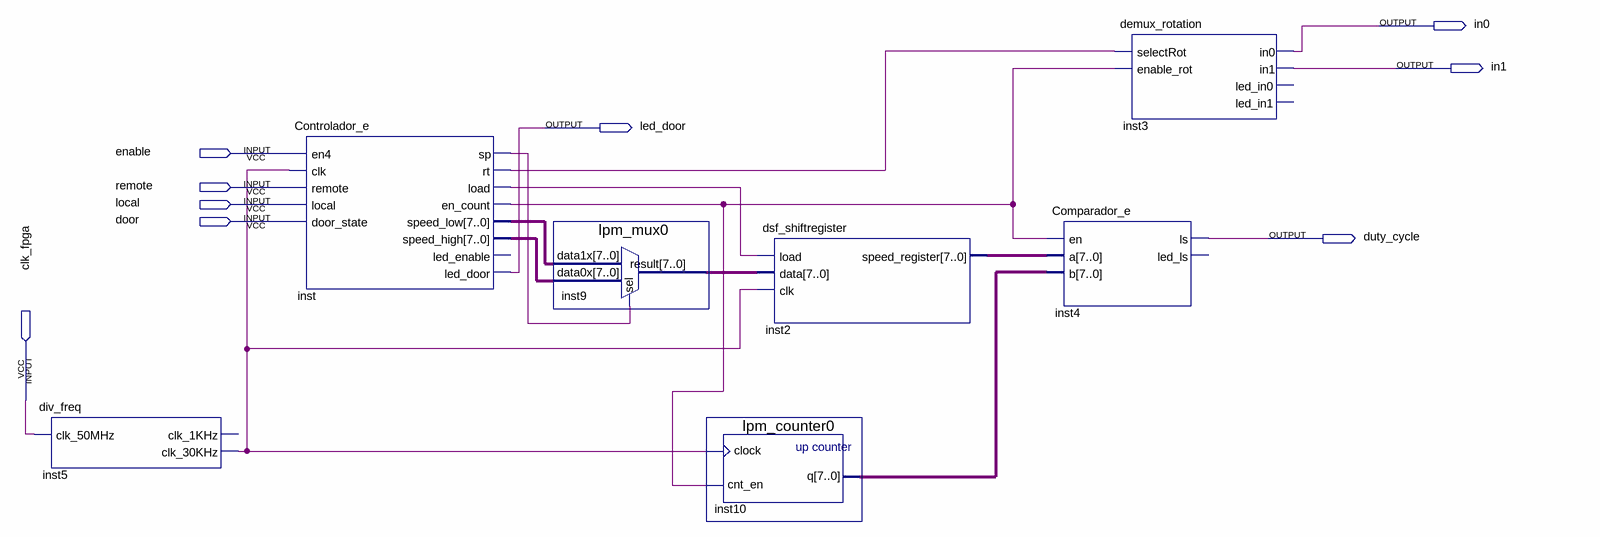
[diagram p0: schematic sheet]
// Quartus schematic motor.bdf as structural Verilog: 7 symbols, 9 pins
module motor (
  input  enable,
  input  remote,
  input  \local ,
  input  door,
  input  clk_fpga,
  output in0,
  output in1,
  output led_door,
  output duty_cycle
);

  wire inst5_clk_30khz, inst_en_count, inst_load, inst_rt, inst_sp;
  wire [7:0] inst2_speed_register, inst9_result, inst10_q, inst_speed_high, inst_speed_low;

  div_freq inst5 (.clk_50MHz(clk_fpga), .clk_30KHz(inst5_clk_30khz));  // open: clk_1KHz
  Controlador_e inst (
    .en4(enable), .clk(inst5_clk_30khz), .remote(remote), .\local (\local ), .door_state(door), .sp(inst_sp),
    .rt(inst_rt), .load(inst_load), .en_count(inst_en_count), .speed_low(inst_speed_low),
    .speed_high(inst_speed_high), .led_door(led_door));  // open: led_enable
  lpm_mux0 inst9 (.data1x(inst_speed_low), .data0x(inst_speed_high), .sel(inst_sp), .result(inst9_result));
  lpm_counter0 inst10 (.clock(inst5_clk_30khz), .cnt_en(inst_en_count), .q(inst10_q));
  dsf_shiftregister inst2 (
    .load(inst_load), .data(inst9_result), .clk(inst5_clk_30khz), .speed_register(inst2_speed_register));
  Comparador_e inst4 (.en(inst_en_count), .a(inst2_speed_register), .b(inst10_q), .ls(duty_cycle));  // open: led_ls
  demux_rotation inst3 (
    .selectRot(inst_rt), .enable_rot(inst_en_count), .in0(in0), .in1(in1));  // open: led_in0, led_in1
endmodule
